# EAGLE design Vile Boon (EAGLE 9.6.0)
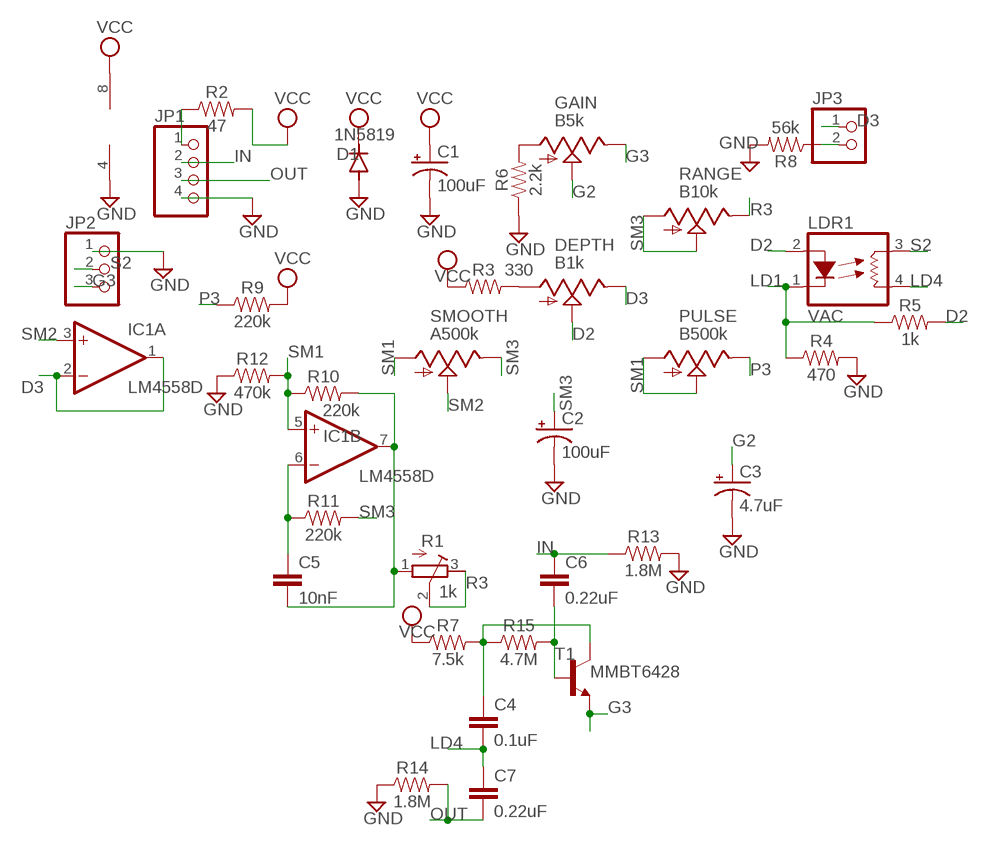
[diagram p0: schematic, sheet 1]

## Parts
C1  100uF  CAP_SMD+THRUPAN_B  [PAN_B_SMD+THRU]
C2  100uF  CAP_SMD+THRUPAN_B  [PAN_B_SMD+THRU]
C3  4.7uF  CAP_SMD+THRUPAN_B  [PAN_B_SMD+THRU]
C4  0.1uF  0.1UF-0603-25V-(+80/-20%)  [0603]
C5  10nF  10NF-0603-50V-10%  [0603]
C6  0.22uF  0.22UF-0603-25V-10%  [0603]
C7  0.22uF  0.22UF-0603-25V-10%  [0603]
D1  1N5819  DIODE-SOD123  [SOD123]
DEPTH  B1k  9MM_SNAP-IN_POT_  [9MM_SNAP-IN_POT]
GAIN  B5k  9MM_SNAP-IN_POT_  [9MM_SNAP-IN_POT]
IC1  LM4558D  [SO08]
JP1  PINHD-1X4  [1X04]
JP2  PINHD-1X3  [1X03]
JP3  PINHD-1X2  [1X02]
LDR1  VAC  VACTROL_4PIN  [VACTROL_4PIN_VTL5C]
PULSE  B500k  9MM_SNAP-IN_POT_  [9MM_SNAP-IN_POT]
R1  1k  R-TRIMM3296W  [RTRIM3296W]
R2  47  47KOHM-0603-1/10W-1%  [0603]
R3  330  47KOHM-0603-1/10W-1%  [0603]
R4  470  47KOHM-0603-1/10W-1%  [0603]
R5  1k  1KOHM-0603-1/10W-1%  [0603]
R6  2.2k  2.2KOHM-0603-1/10W-1%  [0603]
R7  7.5k  6.8KOHM-0603-1/10W-1%  [0603]
R8  56k  47KOHM-0603-1/10W-1%  [0603]
R9  220k  220KOHM-0603-1/10W-1%  [0603]
R10  220k  220KOHM-0603-1/10W-1%  [0603]
R11  220k  220KOHM-0603-1/10W-1%  [0603]
R12  470k  470OHM-0603-1/10W-1%  [0603]
R13  1.8M  1MOHM-0603-1/4W-5%  [0603]
R14  1.8M  1MOHM-0603-1/4W-5%  [0603]
R15  4.7M  4.7KOHM-0603-1/10W-1%  [0603]
RANGE  B10k  9MM_SNAP-IN_POT_  [9MM_SNAP-IN_POT]
SMOOTH  A500k  9MM_SNAP-IN_POT_  [9MM_SNAP-IN_POT]
T1  MMBT6428  BFS17-NPN-SOT23-BEC  [SOT23-BEC]

## Nets
D2: DEPTH.2(S) LDR1.2(LED+) R5.2
D3: DEPTH.3(E) IC1.1(A:OUT) IC1.2(A:-IN) JP3.1
G2: C3.+ C3.++(+) GAIN.2(S)
G3: GAIN.3(E) JP2.3 T1.E
GND: C1.- C1.--(-) C2.- C2.--(-) C3.- C3.--(-) D1.A IC1.4(P:V-) JP1.4 JP2.1 R4.2 R6.1 R8.2 R12.1 R13.2 R14.1
IN: C6.1 JP1.2 R13.1
LD1: LDR1.1(LED-) R4.1 R5.1
LD4: C4.2 C7.1 LDR1.4(RES2)
N$1: C6.2 R15.2 T1.B
N$2: JP3.2 R8.1
N$3: C5.1 IC1.6(B:-IN) R11.1
N$4: C5.2 IC1.7(B:OUT) R1.1(A) R10.2
N$5: DEPTH.1(A) R3.2
N$6: C4.1 R7.2 R15.1 T1.C
N$7: GAIN.1(A) R6.2
N$8: JP1.1 R2.1
OUT: C7.2 JP1.3 R14.2
P3: PULSE.3(E) R9.1
R3: R1.2(S) R1.3(E) RANGE.3(E)
S2: JP2.2 LDR1.3(RES1)
SM1: IC1.5(B:+IN) PULSE.1(A) PULSE.2(S) R10.1 R12.2 SMOOTH.1(A)
SM2: IC1.3(A:+IN) SMOOTH.2(S)
SM3: C2.+ C2.++(+) R11.2 RANGE.1(A) RANGE.2(S) SMOOTH.3(E)
VCC: C1.+ C1.++(+) D1.C IC1.8(P:V+) R2.2 R3.1 R7.1 R9.2

## Library data of the parts
C1-C3 = MusicThingModular:CAP_SMD+THRU
C4 = SparkFun-Capacitors:0.1UF: 0.1µF ceramic capacitors A capacitor is a passive two-terminal electrical component used to store electrical energy temporarily in an electric field.; PROD_ID: CAP-00810
C5 = SparkFun-Capacitors:10NF: 0.01uF/10nF/10,000pF ceramic capacitors A capacitor is a passive two-terminal electrical component used to store electrical energy temporarily in an electric field. CAP-09321; PROD_ID: CAP-00867
C6 C7 = SparkFun-Capacitors:0.22UF: 0.22µF ceramic capacitors A capacitor is a passive two-terminal electrical component used to store electrical energy temporarily in an electric field.; PROD_ID: CAP-07822
D1 = diode:DIODE-: DIODE
DEPTH GAIN PULSE RANGE SMOOTH = MusicThingModular:9MM_SNAP-IN_POT: 9mm vertical snap-in pot, Alpha / Panasonic style
IC1 = linear:*4558: OP AMP
JP1 = Connector:PINHD-1X4: PIN HEADER; CATEGORY: CONNECTOR; SUB-CATEGORY: PIN-HEADER
JP2 = pinhead:PINHD-1X3: PIN HEADER
JP3 = pinhead:PINHD-1X2: PIN HEADER
LDR1 = MusicThingModular:VACTROL_4PIN: 4 Pin Vactrol Resistive Photocoupler
R1 = resistor:R-TRIMM: Trimm resistor
R2-R4 R8 = SparkFun-Resistors:47KOHM: 47kΩ resistor A resistor is a passive two-terminal electrical component that implements electrical resistance as a circuit element. Resistors act to reduce current flow, and, at the same time, act to lower voltage levels within circuits. - Wikipedia; PROD_ID: RES-07871; VALUE: 47k
R5 = SparkFun-Resistors:1KOHM: 1kΩ resistor A resistor is a passive two-terminal electrical component that implements electrical resistance as a circuit element. Resistors act to reduce current flow, and, at the same time, act to lower voltage levels within circuits. - Wikipedia; PROD_ID: RES-07856
R6 = SparkFun-Resistors:2.2KOHM: 2.2kΩ resistor A resistor is a passive two-terminal electrical component that implements electrical resistance as a circuit element. Resistors act to reduce current flow, and, at the same time, act to lower voltage levels within circuits. - Wikipedia; PROD_ID: RES-08272
R7 = SparkFun-Resistors:6.8KOHM: 6.8kΩ resistor A resistor is a passive two-terminal electrical component that implements electrical resistance as a circuit element. Resistors act to reduce current flow, and, at the same time, act to lower voltage levels within circuits. - Wikipedia; PROD_ID: RES-08597; VALUE: 6.8k
R9-R11 = SparkFun-Resistors:220KOHM: 220kΩ resistor A resistor is a passive two-terminal electrical component that implements electrical resistance as a circuit element. Resistors act to reduce current flow, and, at the same time, act to lower voltage levels within circuits. - Wikipedia; PROD_ID: RES-08969
R12 = SparkFun-Resistors:470OHM: 470Ω resistor A resistor is a passive two-terminal electrical component that implements electrical resistance as a circuit element. Resistors act to reduce current flow, and, at the same time, act to lower voltage levels within circuits. - Wikipedia; PROD_ID: RES-07869; VALUE: 470
R13 R14 = SparkFun-Resistors:1MOHM: 1MΩ resistor A resistor is a passive two-terminal electrical component that implements electrical resistance as a circuit element. Resistors act to reduce current flow, and, at the same time, act to lower voltage levels within circuits. - Wikipedia; PROD_ID: RES-07868; VALUE: 1M
R15 = SparkFun-Resistors:4.7KOHM: 4.7kΩ resistor A resistor is a passive two-terminal electrical component that implements electrical resistance as a circuit element. Resistors act to reduce current flow, and, at the same time, act to lower voltage levels within circuits. - Wikipedia; PROD_ID: RES-07857; VALUE: 4.7k
T1 = MusicThingModular:*-NPN-: NPN Transistror BF959 corrected 2008.03.06

## Board
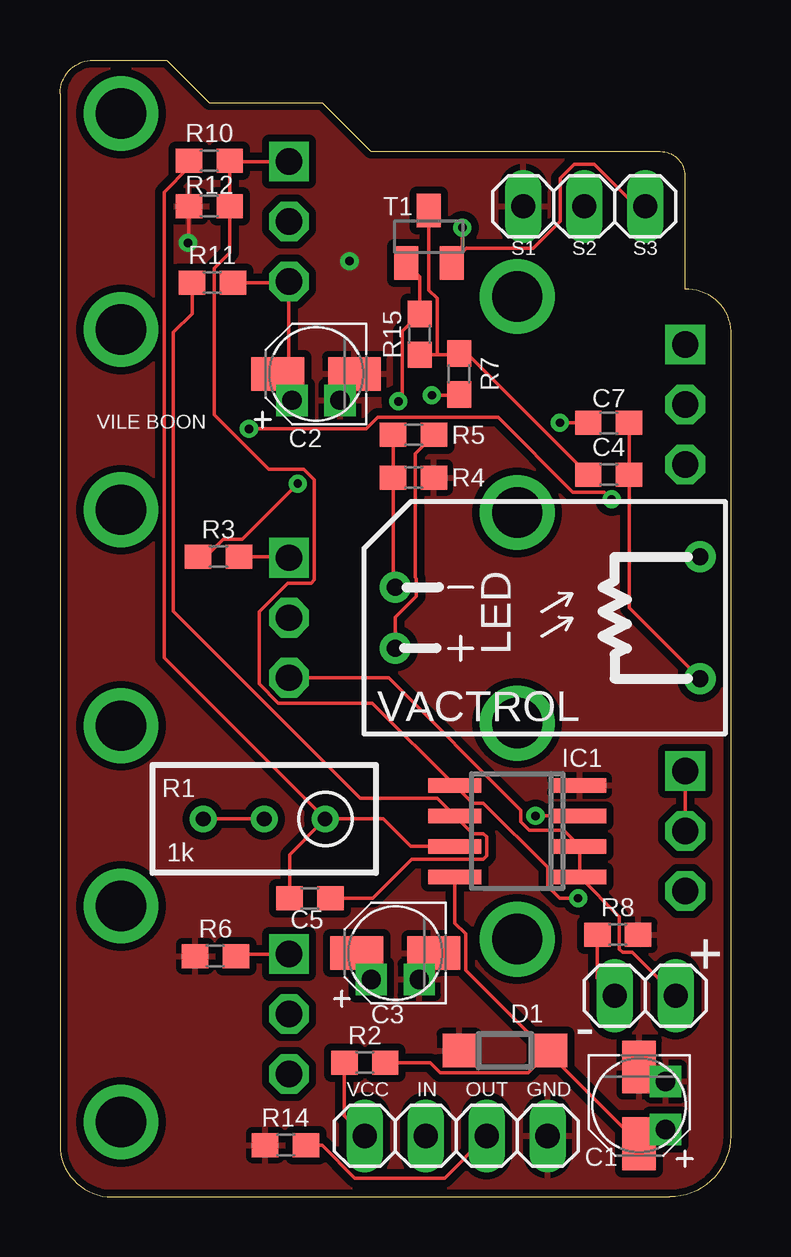
[diagram p1: board, top side]
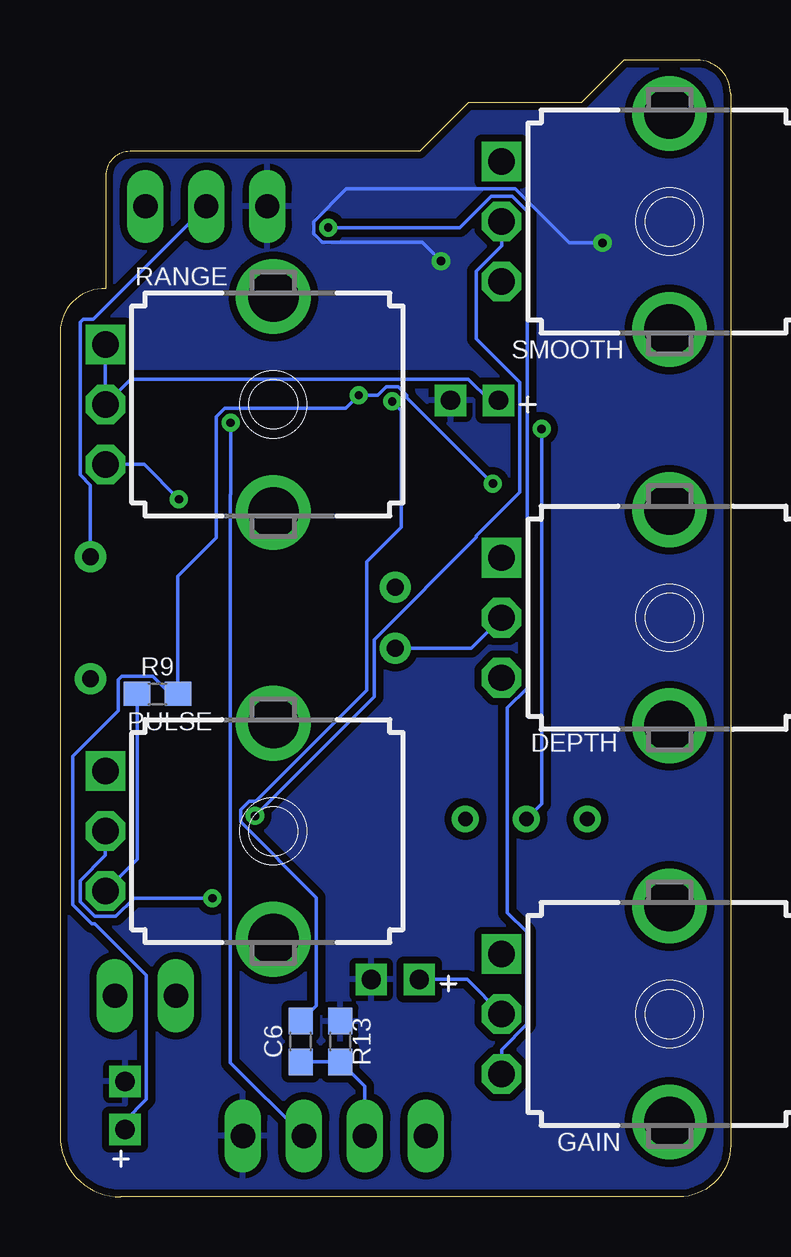
[diagram p2: board, bottom side, seen from below]

Size 27.94 x 47.37 mm. Coordinates in mm from the lower left corner, seen from the top.
Outline: 2.16,0 25.4,0 arc90 27.94,2.54 27.94,36.07 arc90 26.04,37.85 26.04,42.55 arc90 25.02,43.56 12.95,43.56 10.92,45.59 6.22,45.59 4.45,47.37 1.4,47.37 arc90 0,45.97 0,2.16 arc90 2.16,0
Copper layers (1*16): Top 0.035mm / dielectric 1.5mm / Bottom 0.035mm
Design rules "default *": minimum track width 6mil, minimum drill 0.35mm, track to track 6mil, track to pad 6mil, pad to pad 6mil, via to via 6mil, smd to smd 6mil, copper to edge 6mil, drill to drill 6mil, minimum pad ring 10mil, minimum via ring 8mil, stop-mask expansion 4mil, vias tented up to drill 0mil, thermal gap 10mil

### Footprints (pad centres in the part's own frame; a part is rotated, then mirrored left to right if it is on the bottom)
PAN_B_SMD+THRU = smd 2.2 x 1.4: + 1.6,0; - -1.6,0 | drill 0.8 pad 0.9 square: ++ 1,1.1; -- -1,1.1
0603 = smd 1.1 x 1: 1 -0.85,0; 2 0.85,0
SOD123 = smd 1.4 x 1.4: A 1.9,0; C -1.9,0
9MM_SNAP-IN_POT = drill 1.1 square: 1 -2.5,-7 | drill 1.1 octagon: 2 0,-7; 3 2.5,-7 | drill 2.1 pad 2.794: CHASSIS1 -4.5,0; CHASSIS2 4.5,0
SO08 = smd 0.6 x 2.2: 1 -1.905,-2.6; 2 -0.635,-2.6; 3 0.635,-2.6; 4 1.905,-2.6; 5 1.905,2.6; 6 0.635,2.6; 7 -0.635,2.6; 8 -1.905,2.6
1X04 = drill 1.016 long: 1 -3.81,0; 2 -1.27,0; 3 1.27,0; 4 3.81,0
1X03 = drill 1.016 long: 1 -2.54,0; 2 0,0; 3 2.54,0
1X02 = drill 1.016 long: 1 -1.27,0; 2 1.27,0
VACTROL_4PIN_VTL5C = drill 0.7 pad 1.3: 1 -6.35,1.27; 2 -6.35,-1.27; 3 6.35,2.54; 4 6.35,-2.54
RTRIM3296W = drill 0.61: 1 0,-2.54; 2 0,0; 3 0,2.54
SOT23-BEC = smd 1 x 1.4: B -0.95,-1.1; C 0,1.1; E 0.95,-1.1

### Placement (x,y rotation side)
C1  24.13,3.81 270 top
C2  10.67,34.29 180 top
C3  13.97,10.16 180 top
C4  22.86,30.1 0 top
C5  10.41,12.45 180 top
C6  17.91,6.48 90 bottom
C7  22.86,32.26 180 top
D1  18.54,6.1 180 top
DEPTH  2.54,24.13 270 bottom
GAIN  2.54,7.62 270 bottom
IC1  19.05,15.24 90 top
JP1  16.51,2.54 0 top
JP2  21.84,41.27 0 top
JP3  24.38,8.38 180 top
LDR1  20.32,24.13 0 top
PULSE  19.05,15.24 270 bottom
R1  8.51,15.75 90 top
R2  12.7,5.59 0 top
R3  6.6,26.67 0 top
R4  14.73,29.97 0 top
R5  14.73,31.75 0 top
R6  6.48,10.03 0 top
R7  16.64,34.29 90 top
R8  23.24,10.92 0 top
R9  23.88,20.95 0 bottom
R10  6.22,43.18 180 top
R11  6.35,38.1 0 top
R12  6.22,41.27 0 top
R13  16.26,6.48 90 bottom
R14  9.4,2.16 0 top
R15  14.99,35.94 90 top
RANGE  19.05,33.02 270 bottom
SMOOTH  2.54,40.64 270 bottom
T1  15.37,40.01 0 top

### Tracks (layer width: path | path; a pad name or v marks a point on that pad's centre or on a via)
D2
  Top 0.152: LDR1.2 13.97,24.16 14.85,25.04 14.85,25.76 14.8,25.81 14.8,30.97 R5.2
  Bottom 0.152: LDR1.2 10.81,22.86 DEPTH.2
D3
  Top 0.152: JP3.1 23.84,10.19 23.45,10.19 23.31,10.33 23.31,11.67 IC1.1 IC1.2 20.99,15.27 19.56,15.27 19.2,15.62 19.2,16.11 13.69,21.63 DEPTH.3
G2
  Top 0.152: C3.++ 12.37,9.66 C3.+
  Bottom 0.152: GAIN.2 10.98,9.06 C3.++
G3  (via drill 0.35)
  Top 0.152: T1.E 16.71,39.3 16.76,39.35 | 16.76,39.35 16.93,39.52 19.71,39.52 20.85,40.66 20.85,42.45 21.43,43.03 22.25,43.03 24.01,41.27 JP2.3 | v16.76,40.39 16.76,39.35
  Bottom 0.152: GAIN.3 9.54,6.13 8.49,7.18 8.49,11.04 9.3,11.85 9.3,20.38 8.48,21.2 8.48,41.07 9.1,41.69 9.98,41.69 11.28,40.39 v16.76,40.39
GND  (via drill 0.35)
  Top 0.152: R12.1 5.37,39.79 v5.33,39.75 | C1.-- 24.73,4.81 C1.- | C2.-- 11.67,33.69 C2.-
  Bottom 0.152: v5.33,39.75 6.73,39.75 8.98,42 16.01,42 17.37,40.64 17.37,40.13 17.02,39.78 12.86,39.78 v12.06,38.99
  pour Top (isolate 0.305): -0.13,-0.13 28.07,-0.13 28.07,47.62 -0.13,47.62
  pour Bottom (isolate 0.305): -0.13,-0.13 28.07,-0.13 28.07,47.62 -0.13,47.62
IN
  Bottom 0.152: JP1.2 15.24,4.61 R13.1 C6.1
LD1
  Top 0.152: R5.1 R4.1 13.88,25.49 LDR1.1
LD4
  Top 0.152: LDR1.4 23.71,24.55 23.71,29.84 C4.2 C7.1
N$1  (via drill 0.35)
  Top 0.152: T1.B 14.99,38.34 R15.2 14.26,36.06 14.26,33.31 v14.1,33.15
  Bottom 0.152: v14.1,33.15 13.72,32.77 13.72,27.91 15.15,26.48 15.15,21.11 19.78,16.48 20.06,16.48 20.42,16.13 20.42,15.62 17.26,12.47 17.26,7.97 C6.2
N$2
  Top 0.152: JP3.2 22.39,9.11 R8.1
N$3
  Top 0.152: C5.1 13.02,12.45 14.65,14.08 17.64,14.08 17.78,14.21 17.78,15 17.64,15.13 17.19,15.13 IC1.6 15.71,16.62 12.51,16.62 4.72,24.4 4.72,36.03 5.5,36.81 R11.1
N$4
  Top 0.152: R1.1 9.56,14.26 C5.2 | R1.1 13.46,15.75 14.61,14.61 IC1.7 | R10.2 5.37,42.9 4.34,41.87 4.34,22.46 R1.1
N$5
  Top 0.152: R3.2 9.5,26.67 DEPTH.1
N$6
  Top 0.152: R15.1 15.75,35.09 | 15.75,35.09 16.59,35.09 R7.2 16.97,35.14 C4.1 | T1.C 15.37,37.78 15.71,37.44 15.71,35.12 15.75,35.09
N$7
  Top 0.152: R6.2 7.41,10.12 GAIN.1
N$8
  Top 0.152: JP1.1 11.85,3.39 R2.1
OUT  (via drill 0.35)
  Top 0.152: R14.2 10.92,2.16 12.29,0.79 16.03,0.79 JP1.3 | v20.83,32.26 C7.2
  Bottom 0.152: v20.83,32.26 20.83,29.27 20.84,29.26 20.84,5.6 JP1.3
P3
  Bottom 0.152: R9.1 24.73,14.06 PULSE.3
R3  (via drill 0.35)
  Top 0.152: R1.2 R1.3 | v7.87,32 12.76,32 13.24,32.48 18.26,32.48 21.36,29.37 22.68,29.37 v22.99,29.07
  Bottom 0.152: R1.2 7.87,16.38 v7.87,32 | v22.99,29.07 24.44,30.52 RANGE.3
S2
  Bottom 0.152: JP2.2 26.55,36.57 26.97,36.57 27.1,36.44 27.1,30.08 26.67,29.65 LDR1.3
SM1  (via drill 0.35)
  Top 0.152: PULSE.1 PULSE.2 | SMOOTH.1 7.11,43.14 R10.1 R12.2 7.07,39.35 6.42,38.7 6.42,32.6 8.7,30.32 10.16,30.32 10.59,29.89 10.59,25.71 10.46,25.58 9.5,25.58 8.3,24.38 8.3,21.38 9.1,20.58 13.02,20.58 IC1.5 17.19,16.4 17.64,16.4 20.32,13.73 20.32,12.94 20.82,12.45 v21.59,12.45
  Bottom 0.152: PULSE.2 26.05,14.23 27.1,13.18 27.1,12.3 26.49,11.69 25.61,11.69 24.85,12.45 v21.59,12.45
SM2  (via drill 0.35)
  Top 0.152: v19.81,15.88 IC1.3
  Bottom 0.152: SMOOTH.2 9.54,39.63 10.59,38.58 10.59,35.75 8.79,33.94 8.79,29.36 10.59,27.55 10.59,27.48 14.85,23.22 14.85,20.84 v19.81,15.88
SM3
  Top 0.152: C2.+ 9.11,34.25 | 9.11,34.25 9.67,33.69 C2.++ | SMOOTH.3 9.54,37.97 | 9.54,37.97 9.54,34.69 9.11,34.25 | R11.2 9.41,38.1 9.54,37.97
  Bottom 0.152: RANGE.1 RANGE.2 25,34.07 10.92,34.07 10.04,33.19 C2.++
VCC  (via drill 0.35)
  Top 0.152: C1.++ 24.63,2.21 C1.+ 20.44,5.9 | 20.44,5.9 D1.C 19.51,5.17 15.85,5.17 15.43,5.59 R2.2 | 20.44,5.9 16.9,9.44 16.9,10.96 16.45,11.4 IC1.8 | R7.1 16.6,33.4 v15.49,33.4 | v9.91,29.72 7.59,27.4 6.81,27.4 6.08,26.67 R3.1
  Bottom 0.152: v9.91,29.72 13.49,33.3 13.49,33.4 13.85,33.75 14.35,33.75 14.7,33.4 v15.49,33.4 16.03,32.87 21.08,32.87 21.43,32.51 21.43,27.46 23.03,25.87 R9.2 23.35,20.95 24.08,21.68 25.37,21.68 25.5,21.55 25.5,20.26 27.41,18.36 27.41,12.18 26.61,11.38 26.49,11.38 26.1,10.99 24.35,9.24 24.35,4.06 25.23,3.18 C1.++

### Text on the board
tPlace: S1 | S2 | S3 | 1k | + | - | VCC | IN | OUT | GND
tNames: VILE BOON